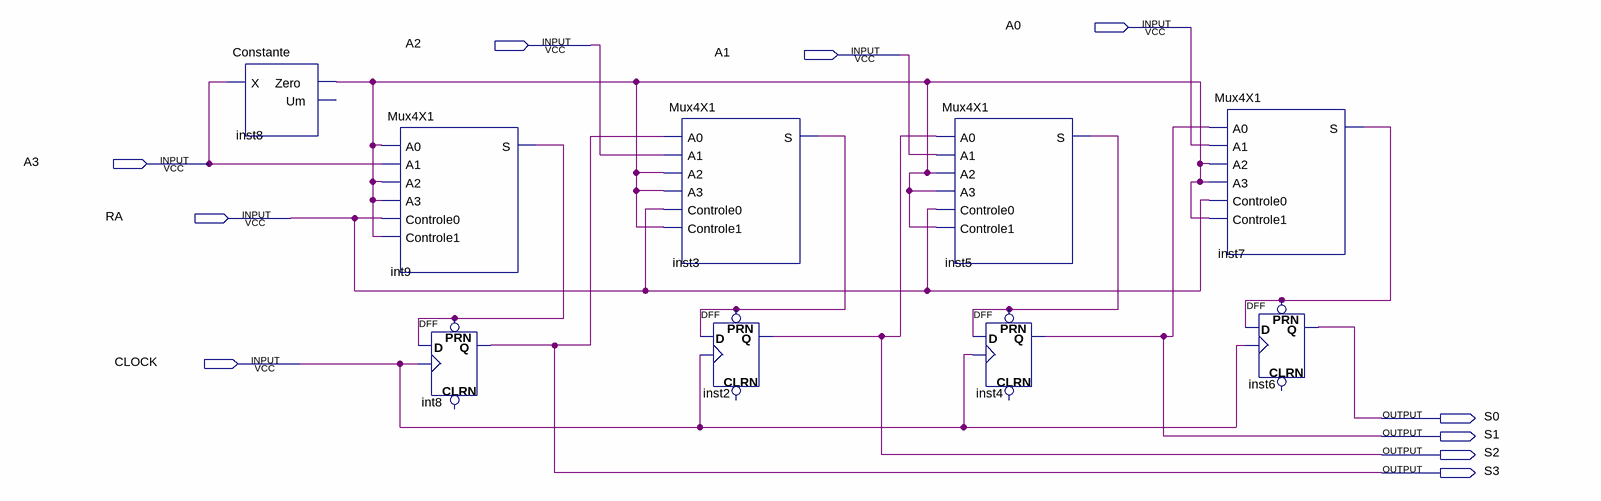
[diagram p0: schematic sheet]
// Quartus schematic Deslocador4B.bdf as structural Verilog: 9 symbols, 10 pins
module Deslocador4B (
  input  A0,
  input  A2,
  input  A1,
  input  A3,
  input  RA,
  input  CLOCK,
  output S0,
  output S1,
  output S2,
  output S3
);

  wire inst3_s, inst5_s, inst7_s, inst8_zero, int9_s;

  Constante inst8 (.X(A3), .Zero(inst8_zero));  // open: Um
  Mux4X1 int9 (
    .A0(inst8_zero), .A1(A3), .A2(inst8_zero), .A3(inst8_zero), .Controle0(RA), .Controle1(inst8_zero),
    .S(int9_s));
  DFF int8 (.CLK(CLOCK), .D(int9_s), .PRN(int9_s), .Q(S3));  // open: CLRN
  Mux4X1 inst3 (
    .A0(S3), .A1(A2), .A2(inst8_zero), .A3(inst8_zero), .Controle0(RA), .Controle1(inst8_zero), .S(inst3_s));
  DFF inst2 (.CLK(CLOCK), .D(inst3_s), .PRN(inst3_s), .Q(S2));  // open: CLRN
  Mux4X1 inst5 (
    .A0(S2), .A1(A1), .A2(inst8_zero), .A3(inst8_zero), .Controle0(RA), .Controle1(inst8_zero), .S(inst5_s));
  DFF inst4 (.CLK(CLOCK), .D(inst5_s), .PRN(inst5_s), .Q(S1));  // open: CLRN
  Mux4X1 inst7 (
    .A0(S1), .A1(A0), .A2(inst8_zero), .A3(inst8_zero), .Controle0(RA), .Controle1(inst8_zero), .S(inst7_s));
  DFF inst6 (.CLK(CLOCK), .D(inst7_s), .PRN(inst7_s), .Q(S0));  // open: CLRN
endmodule
